# EasyEDA Pro project ProProject_【核心板】STC89C52RC最小系统_2024-04-21.epro, board PCB4
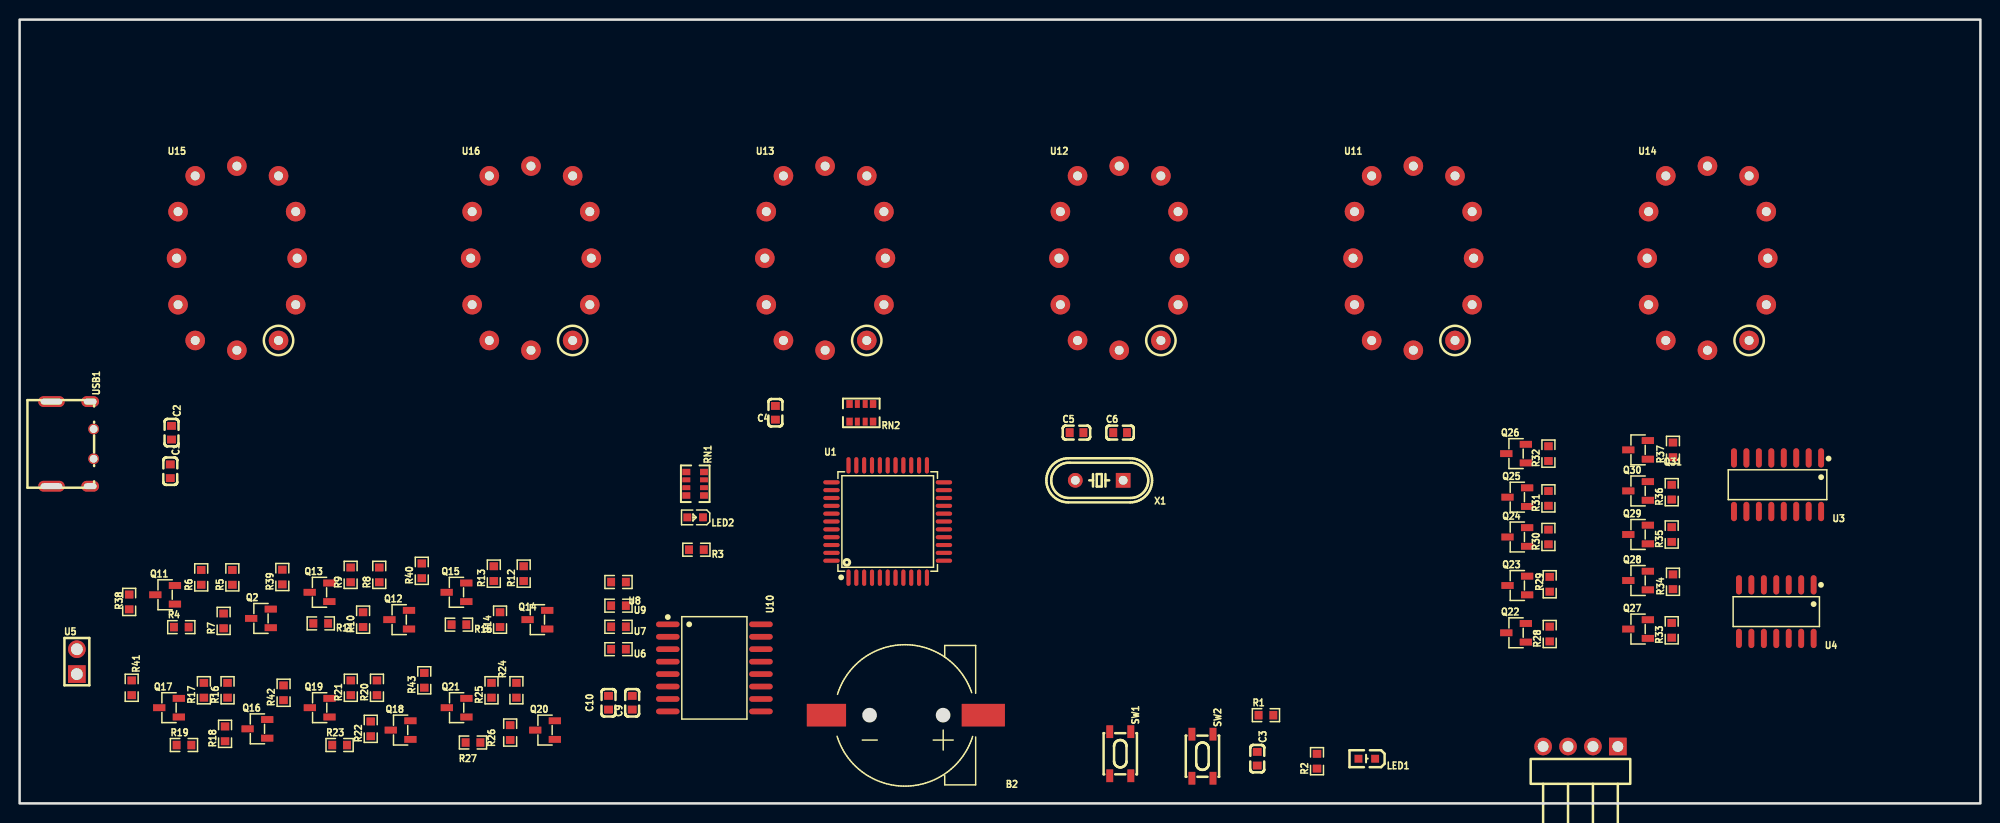
[diagram p1: board, top side]
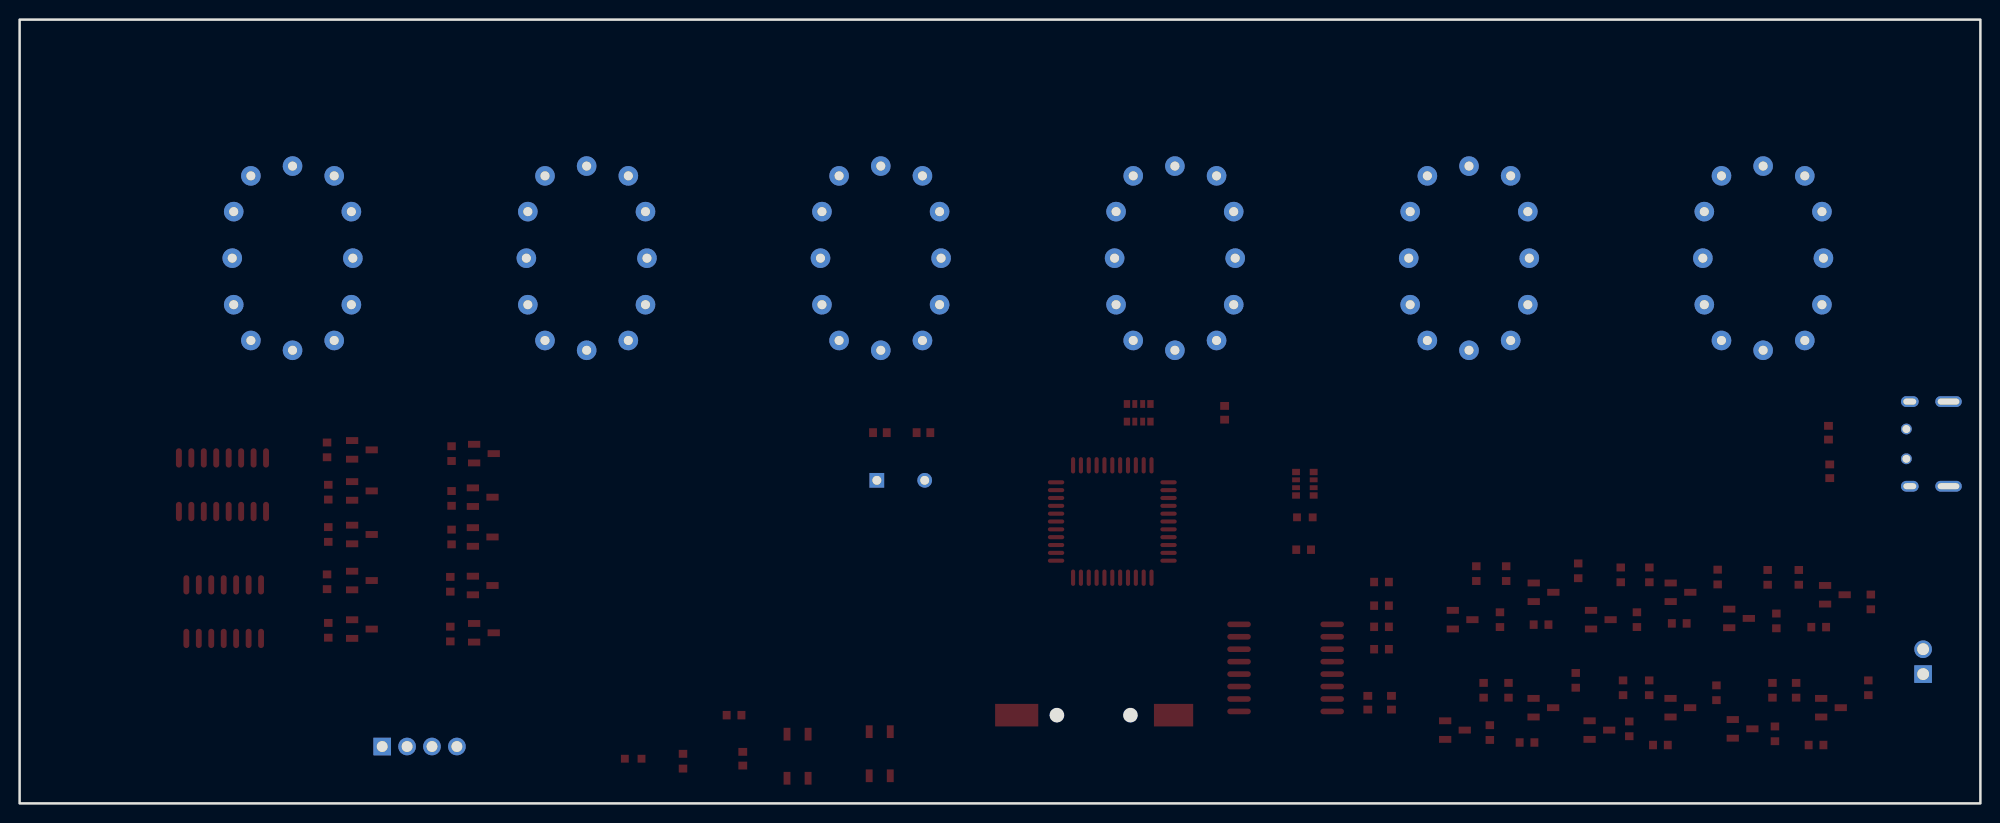
[diagram p2: board, bottom side, seen from below]

Outline 200 x 80 mm; copper layers: Top Layer, Bottom Layer. Coordinates in mm from the lower left corner of the outline.
Outline path: rectangle 0,80 200,0
Stack: Top Layer 0.035mm / Dielectric1 1.51mm FR4 er 4.5 / Bottom Layer 0.035mm

## Design rules (mm)
template: JLCPCB Capability(Two Layers Board)
spacing copperThickness1oz (default): track to track 0.102, other pairs 0.152 to 0.3
spacing copperThickness2oz: track to track 0.203, other pairs 0.152 to 0.3
track width copperThickness1oz (default): min 0.127, default 0.254, max 2.54
track width copperThickness2oz: min 0.203, default 0.254, max 2.54
differential pair differentialPair (default): width min 0.127, default 0.254, max 2.54; gap min 0.152, default 0.152
via viaSize (default): diameter min 0.5, default 0.61, max 10; hole min 0.3, default 0.305, max 6.3

## Placement (name value [footprint] x y rotation side)
B2  CR1220-2  [BAT-SMD_CR1220-2]  90.3 9.01 180 top
C1  10uF  [C0603]  15.37 33.9 270 top
C2  100nF  [C0603]  15.49 37.84 270 top
C3  10uF  [C0603]  126.24 4.56 270 top
C4  100nF  [C0603]  77.09 39.87 270 top
C5  22pF  [C0603]  107.81 37.84 0 top
C6  22pF  [C0603]  112.25 37.84 0 top
C9  1uF  [C0603]  62.48 10.28 90 top
C10  100nF  [C0603]  60.07 10.28 90 top
H1  DZ254W-11-04-65  [HDR-TH_4P-P2.54-H-M-W10.3]  159.21 5.81 180 top
LED1  19-217/R6C-AL1M2VY/3T  [LED0603-R-RD]  137.41 4.56 180 top
LED2  -  [LED0603-RD_BLUE]  68.91 29.2 180 top
Q2  MMBTA42  [SOT-23-3_L2.9-W1.3-P1.90-LS2.4-BR]  24.62 18.88 0 top
Q11  MMBTA92  [SOT-23-3_L2.9-W1.3-P1.90-LS2.4-BR]  14.84 21.29 0 top
Q12  MMBTA42  [SOT-23-3_L2.9-W1.3-P1.90-LS2.4-BR]  38.72 18.75 0 top
Q13  MMBTA92  [SOT-23-3_L2.9-W1.3-P1.90-LS2.4-BR]  30.59 21.55 0 top
Q14  MMBTA42  [SOT-23-3_L2.9-W1.3-P1.90-LS2.4-BR]  52.81 18.75 0 top
Q15  MMBTA92  [SOT-23-3_L2.9-W1.3-P1.90-LS2.4-BR]  44.56 21.55 0 top
Q16  MMBTA42  [SOT-23-3_L2.9-W1.3-P1.90-LS2.4-BR]  24.26 7.61 0 top
Q17  MMBTA92  [SOT-23-3_L2.9-W1.3-P1.90-LS2.4-BR]  15.24 9.77 0 top
Q18  MMBTA42  [SOT-23-3_L2.9-W1.3-P1.90-LS2.4-BR]  38.86 7.48 0 top
Q19  MMBTA92  [SOT-23-3_L2.9-W1.3-P1.90-LS2.4-BR]  30.61 9.77 0 top
Q20  MMBTA42  [SOT-23-3_L2.9-W1.3-P1.90-LS2.4-BR]  53.59 7.48 0 top
Q21  MMBTA92  [SOT-23-3_L2.9-W1.3-P1.90-LS2.4-BR]  44.58 9.77 0 top
Q22  MMBTA42  [SOT-23-3_L2.9-W1.3-P1.90-LS2.4-BR]  152.64 17.41 0 top
Q23  MMBTA42  [SOT-23-3_L2.9-W1.3-P1.90-LS2.4-BR]  152.77 22.24 0 top
Q24  MMBTA42  [SOT-23-3_L2.9-W1.3-P1.90-LS2.4-BR]  152.77 27.19 0 top
Q25  MMBTA42  [SOT-23-3_L2.9-W1.3-P1.90-LS2.4-BR]  152.77 31.26 0 top
Q26  MMBTA42  [SOT-23-3_L2.9-W1.3-P1.90-LS2.4-BR]  152.64 35.7 0 top
Q27  MMBTA42  [SOT-23-3_L2.9-W1.3-P1.90-LS2.4-BR]  165.09 17.79 0 top
Q28  MMBTA42  [SOT-23-3_L2.9-W1.3-P1.90-LS2.4-BR]  165.09 22.75 0 top
Q29  MMBTA42  [SOT-23-3_L2.9-W1.3-P1.90-LS2.4-BR]  165.09 27.45 0 top
Q30  MMBTA42  [SOT-23-3_L2.9-W1.3-P1.90-LS2.4-BR]  165.09 31.89 0 top
Q31  MMBTA42  [SOT-23-3_L2.9-W1.3-P1.90-LS2.4-BR]  165.09 36.08 0 top
R1  10kΩ  [R0603]  127.13 9.01 0 top
R2  10kΩ  [R0603]  132.33 4.31 90 top
R3  10kΩ  [R0603]  69.03 25.89 180 top
R4  750K  [R0603]  16.49 17.99 0 top
R5  750K  [R0603]  21.7 23.07 90 top
R6  10K  [R0603]  18.52 23.07 90 top
R7  10K  [R0603]  20.81 18.63 90 top
R8  750K  [R0603]  36.69 23.33 90 top
R9  10K  [R0603]  33.76 23.33 90 top
R10  10K  [R0603]  35.03 18.75 90 top
R11  750K  [R0603]  30.72 18.37 180 top
R12  750K  [R0603]  51.42 23.45 90 top
R13  10K  [R0603]  48.37 23.45 90 top
R14  10K  [R0603]  49 18.75 90 top
R15  750K  [R0603]  44.81 18.25 180 top
R16  750K  [R0603]  21.21 11.55 90 top
R17  10K  [R0603]  18.8 11.55 90 top
R18  10K  [R0603]  20.95 7.1 90 top
R19  750K  [R0603]  16.76 5.96 0 top
R20  750K  [R0603]  36.45 11.8 90 top
R21  10K  [R0603]  33.78 11.8 90 top
R22  10K  [R0603]  35.81 7.61 90 top
R23  750K  [R0603]  32.64 5.96 0 top
R24  750K  [R0603]  50.67 11.55 90 top
R25  10K  [R0603]  48.13 11.55 90 top
R26  10K  [R0603]  50.04 7.23 90 top
R27  750K  [R0603]  46.24 6.22 0 top
R28  10K  [R0603]  156.07 17.29 90 top
R29  10K  [R0603]  156.07 22.37 90 top
R30  10K  [R0603]  155.94 27.19 90 top
R31  10K  [R0603]  155.94 31.13 90 top
R32  10K  [R0603]  155.94 35.7 90 top
R33  10K  [R0603]  168.51 17.67 90 top
R34  10K  [R0603]  168.64 22.62 90 top
R35  10K  [R0603]  168.51 27.45 90 top
R36  10K  [R0603]  168.51 31.77 90 top
R37  10K  [R0603]  168.64 36.08 90 top
R38  10kΩ  [R0603]  11.18 20.56 90 top
R39  10kΩ  [R0603]  26.8 23.1 90 top
R40  10kΩ  [R0603]  41.02 23.74 90 top
R41  10kΩ  [R0603]  11.43 11.8 270 top
R42  10kΩ  [R0603]  26.92 11.29 90 top
R43  10kΩ  [R0603]  41.28 12.56 90 top
RN1  10kΩ  [res-array-smd_0603-8p-l3.2-w1.6-bl]  68.91 32.63 270 top
RN2  10kΩ  [res-array-smd_0603-8p-l3.2-w1.6-bl]  85.85 39.87 180 top
SW1  PTS815SJK250SMTRLFS  [SW-SMD_4P-L4.2-W3.3-P2.15-LS5.1]  112.27 5.07 270 top
SW2  PTS815SJK250SMTRLFS  [SW-SMD_4P-L4.2-W3.3-P2.15-LS5.1]  120.65 4.82 270 top
U1  STC89C52RC-40I  [LQFP-44_L10.0-W10.0-P0.80-LS12.0-BL]  88.55 28.77 0 top
U3  74HC138D  [SOIC-16_L9.9-W3.9-P1.27-LS6.0-BL]  179.31 32.53 180 top
U4  CD4069  [SOP-14_L8.8-W3.9-P1.27-LS6.0-BL]  179.18 19.57 180 top
U5  54102-T0600LF  [HDR-TH_2P-P2.54-V-M-R2-C1-S2.54]  5.84 14.47 0 top
U6  4.7kΩ  [R0603]  61.09 15.74 180 top
U7  4.7kΩ  [R0603]  61.09 18.02 180 top
U8  4.7kΩ  [R0603]  61.09 22.6 180 top
U9  4.7kΩ  [R0603]  61.09 20.18 180 top
U10  DS3231SN#  [SOIC-16_L10.3-W7.5-P1.27-LS10.3-BL]  70.87 13.83 270 top
U11  -  [IN-12]  142.16 55.65 0 top
U12  -  [IN-12]  112.16 55.65 0 top
U13  -  [IN-12]  82.16 55.65 0 top
U14  -  [IN-12]  172.16 55.65 0 top
U15  -  [IN-12]  22.16 55.65 0 top
U16  -  [IN-12]  52.16 55.65 0 top
USB1  TYPE-C-31-M-33  [USB-C-TH_TYPE-C-31-M-33]  5.4 36.69 270 top
X1  11.0592MHz  [HC-49US_L11.5-W4.5-P4.88]  110.12 32.98 180 top

## Footprints (pads in the part's own frame, mm; a bottom-side part is the same pattern mirrored in y, then rotated)
BAT-SMD_CR1220-2
  rect 4.4x2.3 smd: 1(-8,0)
  rect 4x2.3 smd: 2(8,0)
C0603
  rect 0.8x0.9 smd: 1(-0.7,0) 2(0.7,0)
HC-49US_L11.5-W4.5-P4.88
  rect 1.501x1.501 hole 0.899: 1(-2.441,0)
  round 1.501 hole 0.899: 2(2.441,0)
HDR-TH_2P-P2.54-V-M-R2-C1-S2.54
  rect 1.8x1.8 hole 1.2: 1(0,-1.27)
  round 1.8 hole 1.2: 2(0,1.27)
HDR-TH_4P-P2.54-H-M-W10.3
  rect 1.8x1.8 hole 1.1: 1(-3.81,0)
  round 1.8 hole 1.1: 2(-1.27,0) 3(1.27,0) 4(3.81,0)
IN-12
  round 2 hole 0.914: Hi(4.25,-8.4) N0(6,-4.75) N1(-4.25,-8.4) N2(-6,-4.75) N3(-6.15,-0.001) N4(-6,4.75) N5(-4.25,8.4) N6(0,9.4) N7(4.25,8.4) N8(6,4.75) N9(6.15,-0.001) P(0,-9.4)
LED0603-R-RD
  rect 0.8x0.8 smd: 1(0.851,0) 2(-0.851,0)
LED0603-RD_BLUE
  rect 0.8x0.8 smd: 1(-0.8,-0.003) 2(0.8,0.003)
LQFP-44_L10.0-W10.0-P0.80-LS12.0-BL
  oval 0.419x1.669 smd: 1(-4,-5.736) 2(-3.2,-5.736) 3(-2.401,-5.736) 4(-1.6,-5.736) 5(-0.8,-5.736) 6(0,-5.736) 7(0.8,-5.736) 8(1.6,-5.736) 9(2.401,-5.736) 10(3.2,-5.736) 11(4,-5.736) 23(4,5.736) 24(3.2,5.736) 25(2.401,5.736) 26(1.6,5.736) 27(0.8,5.736) 28(0,5.736) 29(-0.8,5.736) 30(-1.6,5.736) 31(-2.401,5.736) 32(-3.2,5.736) 33(-4,5.736)
  oval 1.669x0.419 smd: 12(5.736,-4) 13(5.736,-3.2) 14(5.736,-2.401) 15(5.736,-1.6) 16(5.736,-0.8) 17(5.736,0) 18(5.736,0.8) 19(5.736,1.6) 20(5.736,2.401) 21(5.736,3.2) 22(5.736,4) 34(-5.736,4) 35(-5.736,3.2) 36(-5.736,2.401) 37(-5.736,1.6) 38(-5.736,0.8) 39(-5.736,0) 40(-5.736,-0.8) 41(-5.736,-1.6) 42(-5.736,-2.401) 43(-5.736,-3.2) 44(-5.736,-4)
R0603
  rect 0.806x0.864 smd: 1(-0.753,0) 2(0.753,0)
res-array-smd_0603-8p-l3.2-w1.6-bl
  rect 0.65x0.8 smd: 1(-1.199,-0.899) 4(1.199,-0.899) 5(1.199,0.899) 8(-1.199,0.899)
  rect 0.5x0.8 smd: 2(-0.399,-0.899) 3(0.402,-0.899) 6(0.402,0.899) 7(-0.399,0.899)
SOIC-16_L9.9-W3.9-P1.27-LS6.0-BL
  oval 0.602x1.971 smd: 1(-4.445,-2.736) 2(-3.175,-2.736) 3(-1.905,-2.736) 4(-0.635,-2.736) 5(0.635,-2.736) 6(1.905,-2.736) 7(3.175,-2.736) 8(4.445,-2.736) 9(4.445,2.736) 10(3.175,2.736) 11(1.905,2.736) 12(0.635,2.736) 13(-0.635,2.736) 14(-1.905,2.736) 15(-3.175,2.736) 16(-4.445,2.736)
SOIC-16_L10.3-W7.5-P1.27-LS10.3-BL
  oval 0.574x2.401 smd: 1(-4.445,-4.75) 2(-3.175,-4.75) 3(-1.905,-4.75) 4(-0.635,-4.75) 5(0.635,-4.75) 6(1.905,-4.75) 7(3.175,-4.75) 8(4.445,-4.75) 9(4.445,4.75) 10(3.175,4.75) 11(1.905,4.75) 12(0.635,4.75) 13(-0.635,4.75) 14(-1.905,4.75) 15(-3.175,4.75) 16(-4.445,4.75)
SOP-14_L8.8-W3.9-P1.27-LS6.0-BL
  oval 0.595x1.968 smd: 1(-3.81,-2.734) 2(-2.54,-2.734) 3(-1.27,-2.734) 4(0,-2.734) 5(1.27,-2.734) 6(2.54,-2.734) 7(3.81,-2.734) 8(3.81,2.733) 9(2.54,2.733) 10(1.27,2.733) 11(0,2.733) 12(-1.27,2.733) 13(-2.54,2.733) 14(-3.81,2.733)
SOT-23-3_L2.9-W1.3-P1.90-LS2.4-BR
  rect 1.25x0.7 smd: 1(1,-0.95) 2(1,0.95) 3(-1,0)
SW-SMD_4P-L4.2-W3.3-P2.15-LS5.1
  rect 1.3x0.701 smd: 1(-2.251,1.075) 2(2.251,1.075) 3(-2.251,-1.075) 4(2.251,-1.075)
USB-C-TH_TYPE-C-31-M-33
  oval 1.1x1.8 hole 0.6x1.3: 3(4.32,1.8) 6(-4.32,1.8)
  oval 1.1x2.7 hole 0.6x2.2: 4(4.32,-2.15) 5(-4.32,-2.15)
  round 1.1 hole 0.8: A9(1.52,2.15) B12(-1.52,2.15)

## Nets
As in the schematic, except:
GND2: B2.1 C1.2 C2.1 C4.2 C5.2 C6.2 C9.1 C10.1 H1.4 LED1.2 LED2.2 R1.2 SW2.1 SW2.2 U3.4 U3.5 U3.8 U4.7 U10.5 U10.6 U10.7 U10.8 U10.9 U10.10 U10.11 U10.12 U10.13 USB1.3 USB1.4 USB1.5 USB1.6 USB1.B12
VCC: R5.2 R6.2 R8.2 R9.2 R12.2 R13.2 R16.2 R17.2 R20.2 R21.2 R24.2 R25.2 U5.2
BAT: B2.2 U10.14
$1N3048: Q13.2 R9.1
$1N3052: Q12.3 R8.1 R11.2

Pads without a net: U3 7; U10 4; U11 P; U12 P; U13 P; U14 P; U15 P; U16 P
